# EAGLE design const_current_x4 (EAGLE 7.6.0)
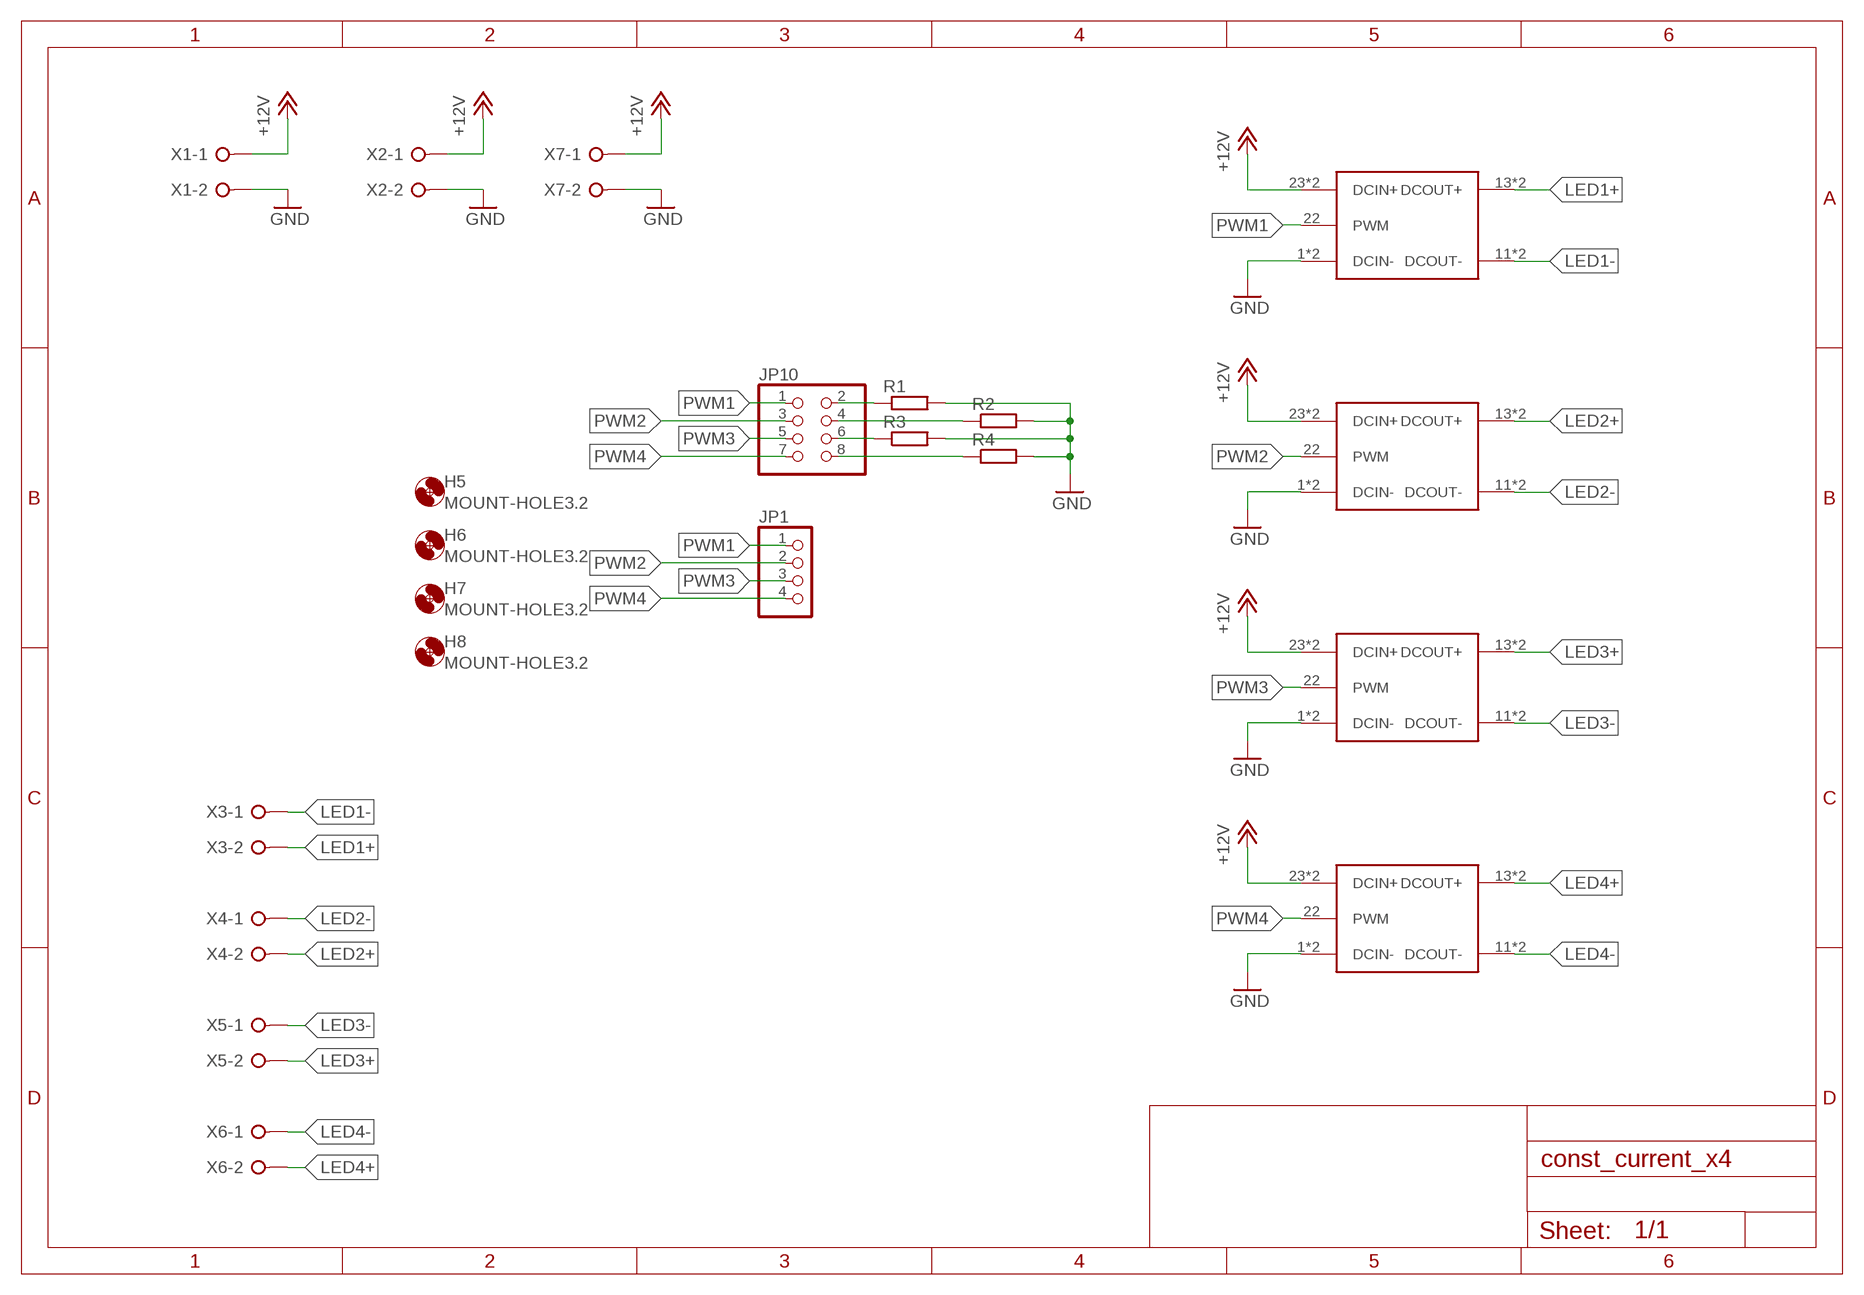
[diagram p0: schematic, sheet 1]

## Parts
H5  MOUNT-HOLE3.2  [3,2]
H6  MOUNT-HOLE3.2  [3,2]
H7  MOUNT-HOLE3.2  [3,2]
H8  MOUNT-HOLE3.2  [3,2]
JP1  PINHD-1X4  [1X04]
JP10  PINHD-2X4  [2X04]
R1  R-EU_0207/10  [0207/10]
R2  R-EU_0207/10  [0207/10]
R3  R-EU_0207/10  [0207/10]
R4  R-EU_0207/10  [0207/10]
U$5  LDD_H  [LDD_H]
U$6  LDD_H  [LDD_H]
U$7  LDD_H  [LDD_H]
U$8  LDD_H  [LDD_H]
X1  W237-02P  [W237-132]
X2  W237-02P  [W237-132]
X3  W237-02P  [W237-132]
X4  W237-02P  [W237-132]
X5  W237-02P  [W237-132]
X6  W237-02P  [W237-132]
X7  W237-02P  [W237-132]

## Nets
+12V: U$5.23(DCIN+) U$5.24(DCIN+) U$6.23(DCIN+) U$6.24(DCIN+) U$7.23(DCIN+) U$7.24(DCIN+) U$8.23(DCIN+) U$8.24(DCIN+) X1.1 X2.1 X7.1
GND: R1.2 R2.2 R3.2 R4.2 U$5.1(DCIN-) U$5.2(DCIN-) U$6.1(DCIN-) U$6.2(DCIN-) U$7.1(DCIN-) U$7.2(DCIN-) U$8.1(DCIN-) U$8.2(DCIN-) X1.2 X2.2 X7.2
LED1+: U$5.13(DCOUT+) U$5.14(DCOUT+) X3.2
LED1-: U$5.11(DCOUT-) U$5.12(DCOUT-) X3.1
LED2+: U$6.13(DCOUT+) U$6.14(DCOUT+) X4.2
LED2-: U$6.11(DCOUT-) U$6.12(DCOUT-) X4.1
LED3+: U$7.13(DCOUT+) U$7.14(DCOUT+) X5.2
LED3-: U$7.11(DCOUT-) U$7.12(DCOUT-) X5.1
LED4+: U$8.13(DCOUT+) U$8.14(DCOUT+) X6.2
LED4-: U$8.11(DCOUT-) U$8.12(DCOUT-) X6.1
N$5: JP10.2 R1.1
N$6: JP10.4 R2.1
N$7: JP10.6 R3.1
N$8: JP10.8 R4.1
PWM1: JP1.1 JP10.1 U$5.22(PWM)
PWM2: JP1.2 JP10.3 U$6.22(PWM)
PWM3: JP1.3 JP10.5 U$7.22(PWM)
PWM4: JP1.4 JP10.7 U$8.22(PWM)

## Library data of the parts
H5-H8 = holes:MOUNT-HOLE: MOUNTING HOLE with drill center marker
JP1 = pinhead:PINHD-1X4: PIN HEADER
JP10 = pinhead:PINHD-2X4: PIN HEADER
R1-R4 = resistor:R-EU_: RESISTOR, European symbol
U$5-U$8 = meanwell_dcdc:LDD_H
X1-X7 = con-wago-508:W237-02P: WAGO SREW CLAMP; OC_FARNELL: unknown; OC_NEWARK: unknown

## Board
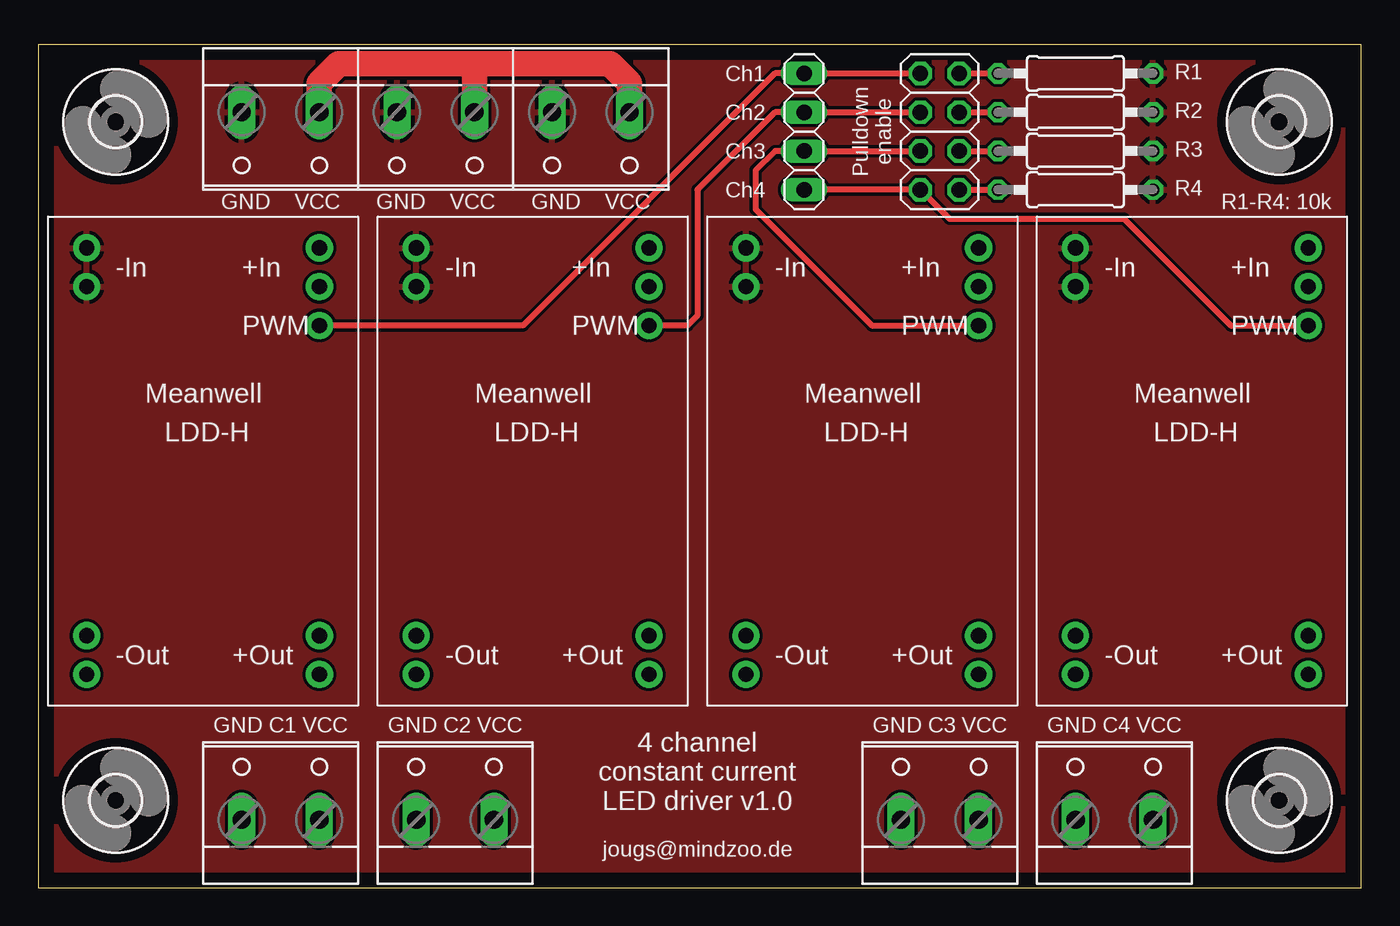
[diagram p1: board, top side]
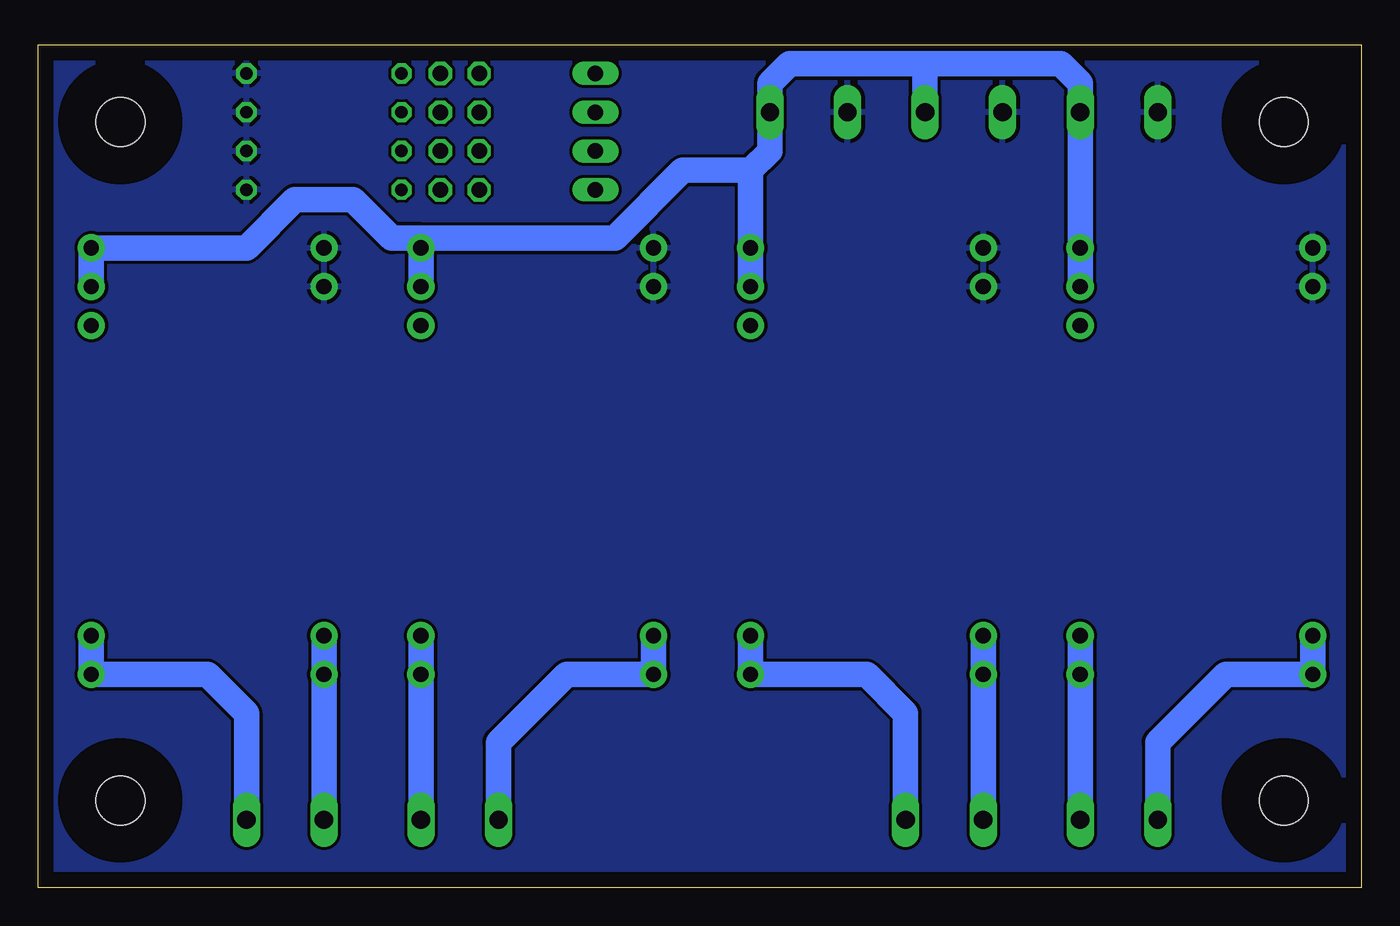
[diagram p2: board, bottom side, seen from below]

Size 86.67 x 55.23 mm. Coordinates in mm from the lower left corner, seen from the top.
Outline: 0,0 86.67,0 86.67,55.23 0,55.23 0,0
Copper layers (1*16): Top 0.035mm / dielectric 1.5mm / Bottom 0.035mm
Design rules "default": minimum track width 10mil, minimum drill 24mil, track to track 8mil, track to pad 8mil, pad to pad 8mil, via to via 8mil, smd to smd 8mil, copper to edge 40mil, drill to drill 8mil, minimum pad ring 10mil, minimum via ring 8mil, stop-mask expansion 4mil, vias tented up to drill 0mil, thermal gap 10mil

### Footprints (pad centres in the part's own frame; a part is rotated, then mirrored left to right if it is on the bottom)
3,2 = hole 3.2: 0,0
1X04 = drill 1.016 long: 1 -3.81,0; 2 -1.27,0; 3 1.27,0; 4 3.81,0
2X04 = drill 1.016 octagon: 1 -3.81,-1.27; 2 -3.81,1.27; 3 -1.27,-1.27; 4 -1.27,1.27; 5 1.27,-1.27; 6 1.27,1.27; 7 3.81,-1.27; 8 3.81,1.27
0207/10 = drill 0.813 octagon: 1 -5.08,0; 2 5.08,0
LDD_H = drill 1 pad 1.778: 1 -7.62,13.97; 2 -7.62,11.43; 11 -7.62,-11.43; 12 -7.62,-13.97; 13 7.62,-13.97; 14 7.62,-11.43; 22 7.62,8.89; 23 7.62,11.43; 24 7.62,13.97
W237-132 = drill 1.194 long: 1 -2.54,-0.635; 2 2.54,-0.635

### Placement (x,y rotation side)
H5  5.08,5.71 0 top
H6  81.28,5.71 0 top
H7  5.08,50.16 0 top
H8  81.28,50.16 0 top
JP1  50.16,49.53 270 top
JP10  59.05,49.53 270 top
R1  67.94,53.34 0 top
R2  67.94,50.8 0 top
R3  67.94,48.26 0 top
R4  67.94,45.72 0 top
U$5  10.79,27.94 0 top
U$6  32.38,27.94 0 top
U$7  53.98,27.94 0 top
U$8  75.56,27.94 0 top
X1  15.88,50.16 180 top
X2  26.04,50.16 180 top
X3  15.88,5.08 0 top
X4  27.3,5.08 0 top
X5  59.05,5.08 0 top
X6  70.48,5.08 0 top
X7  36.2,50.16 180 top

### Tracks (layer width: path | path; a pad name or v marks a point on that pad's centre or on a via)
+12V
  Top 1.676: X1.1 18.41,52.7 19.68,53.98 28.57,53.98 | 28.57,53.98 37.47,53.98 38.73,52.7 X7.1 | X2.1 28.57,53.98
  Bottom 1.27: U$7.24 61.59,42.55
  Bottom 1.676: U$8.23 U$8.24 73.03,41.91 69.85,45.09 66.04,45.09 63.5,42.55 61.59,42.55 48.9,42.55 44.45,46.99 40.01,46.99 | U$7.23 U$7.24 | U$6.23 U$6.24 40.01,46.99 | U$5.23 U$5.24 X1.1 18.41,52.7 19.68,53.98 28.57,53.98 | X2.1 28.57,53.98 | 40.01,46.99 38.73,48.26 X7.1 38.73,52.7 37.47,53.98 28.57,53.98
GND
  pour Bottom: -1.27,55.24 0,0 86.36,0 86.36,55.24
  pour Top: -3.81,55.24 0,0 86.36,0 86.36,55.24
LED1+
  Bottom 1.676: U$5.14 U$5.13 X3.2
LED1-
  Bottom 1.676: U$5.11 U$5.12 8.89,13.97 13.34,9.53 X3.1
LED2+
  Bottom 1.676: U$6.14 U$6.13 32.38,13.97 29.84,11.43 X4.2
LED2-
  Bottom 1.676: U$6.11 U$6.12 X4.1
LED3+
  Bottom 1.676: U$7.14 U$7.13 X5.2
LED3-
  Bottom 1.676: U$7.11 U$7.12 52.07,13.97 56.52,9.53 X5.1
LED4+
  Bottom 1.676: U$8.14 U$8.13 75.56,13.97 73.03,11.43 X6.2
LED4-
  Bottom 1.676: U$8.11 U$8.12 X6.1
N$5
  Top 0.406: JP10.2 R1.1
N$6
  Top 0.406: JP10.4 R2.1
N$7
  Top 0.406: JP10.6 R3.1
N$8
  Top 0.406: JP10.8 R4.1
PWM1
  Top 0.406: U$5.22 31.75,36.83 48.26,53.34 JP1.1 JP10.1
PWM2
  Top 0.406: U$6.22 42.55,36.83 43.18,37.47 43.18,45.72 48.26,50.8 JP1.2 JP10.3
PWM3
  Top 0.406: U$7.22 54.61,36.83 46.99,44.45 46.99,46.99 48.26,48.26 JP1.3 JP10.5
PWM4
  Top 0.406: U$8.22 78.11,36.83 71.12,43.81 59.69,43.81 JP10.7 JP1.4

### Text on the board
tPlace: Ch1 | Ch2 | Pulldown / enable | Ch3 | Ch4 | GND VCC | GND VCC | GND VCC | GND C1 VCC | GND C2 VCC | GND C3 VCC | GND C4 VCC | 4 channel / constant current / LED driver v1.0 | jougs@mindzoo.de
tNames: R1-R4: 10k